# EAGLE board KramerMC_CPU_ferryTALE2020 (EAGLE 6.6.0), part 1 of 2
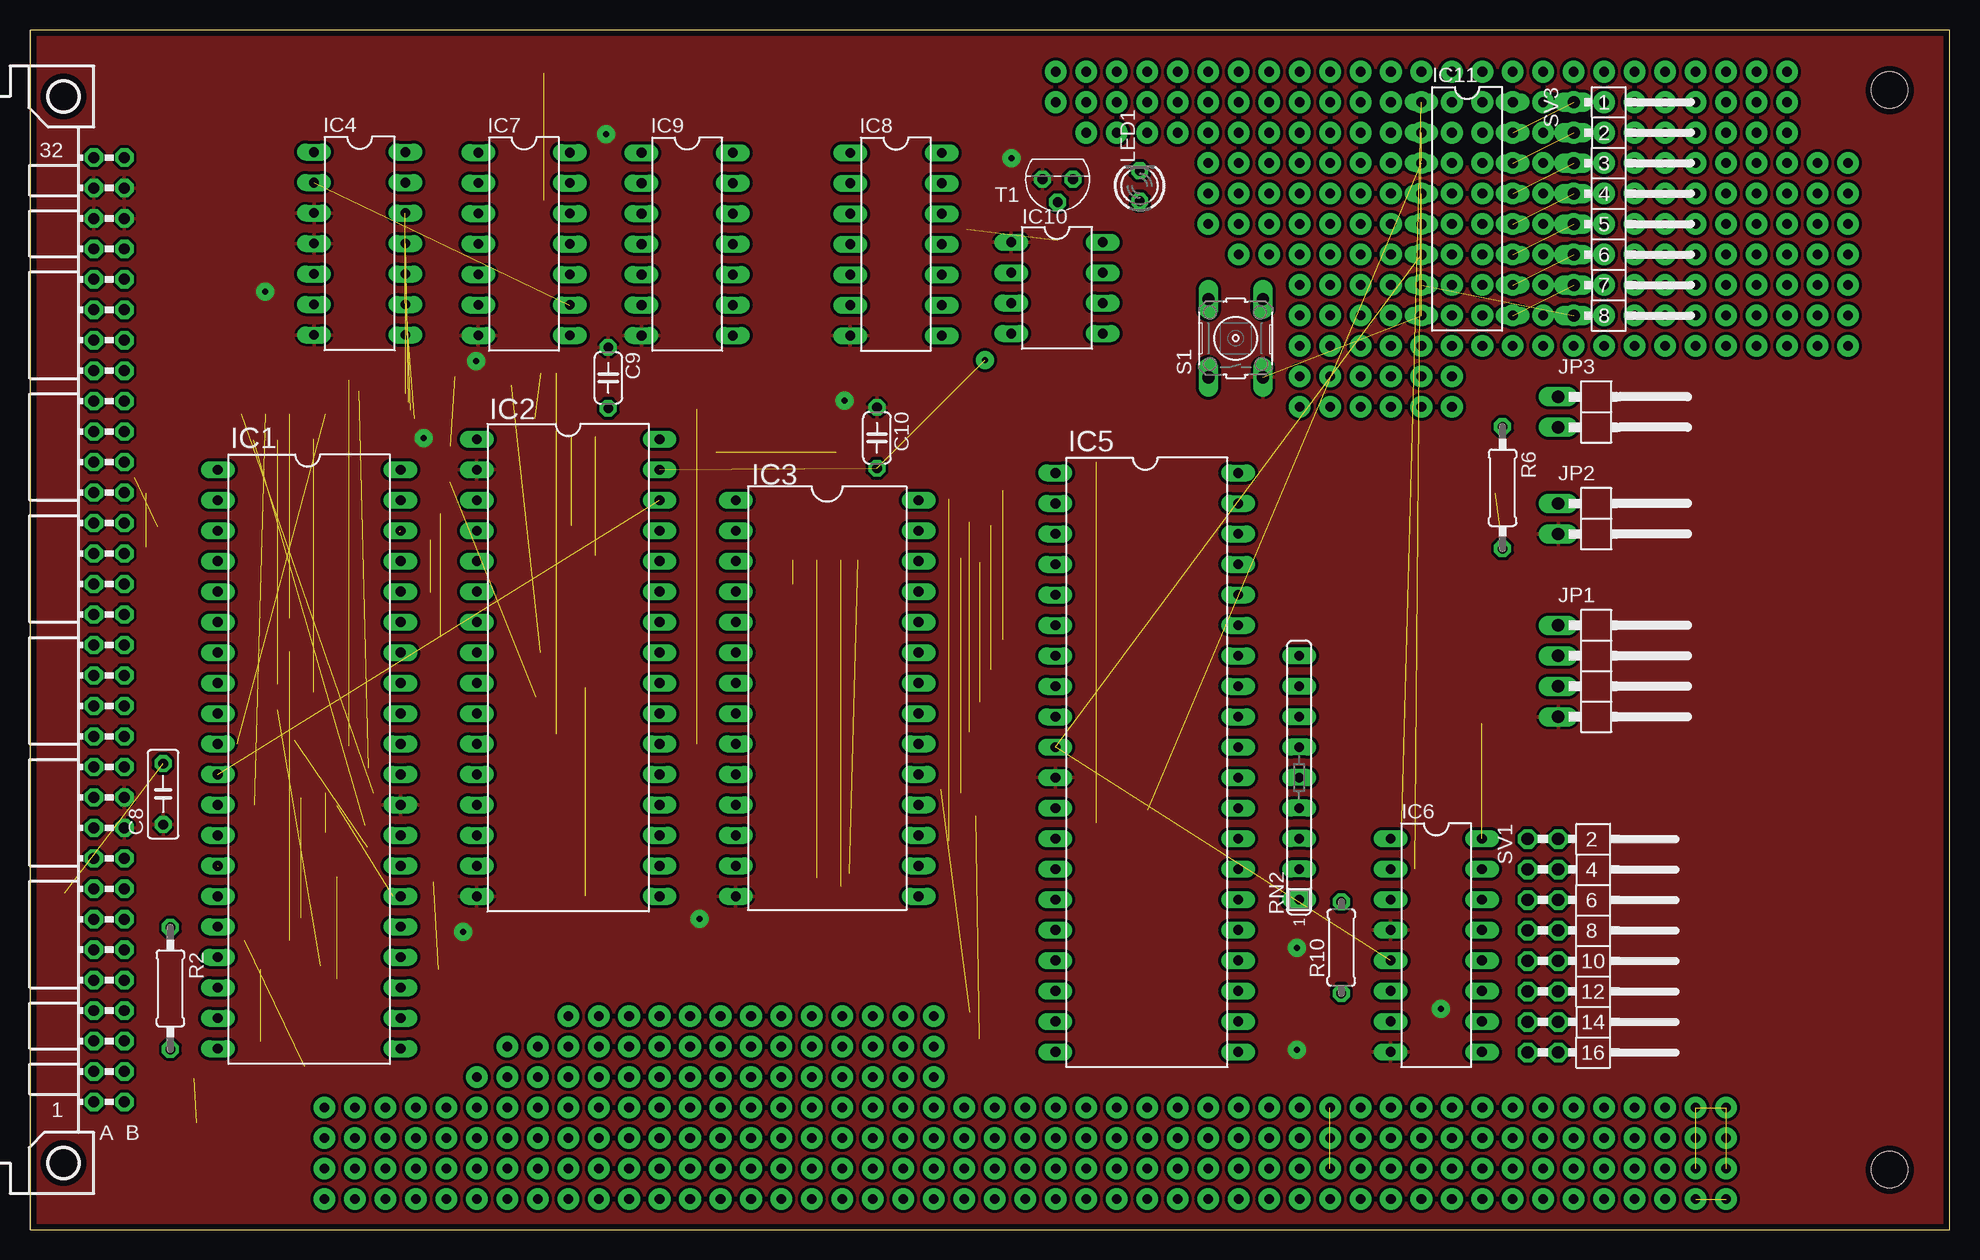
[diagram p2: board, top side]
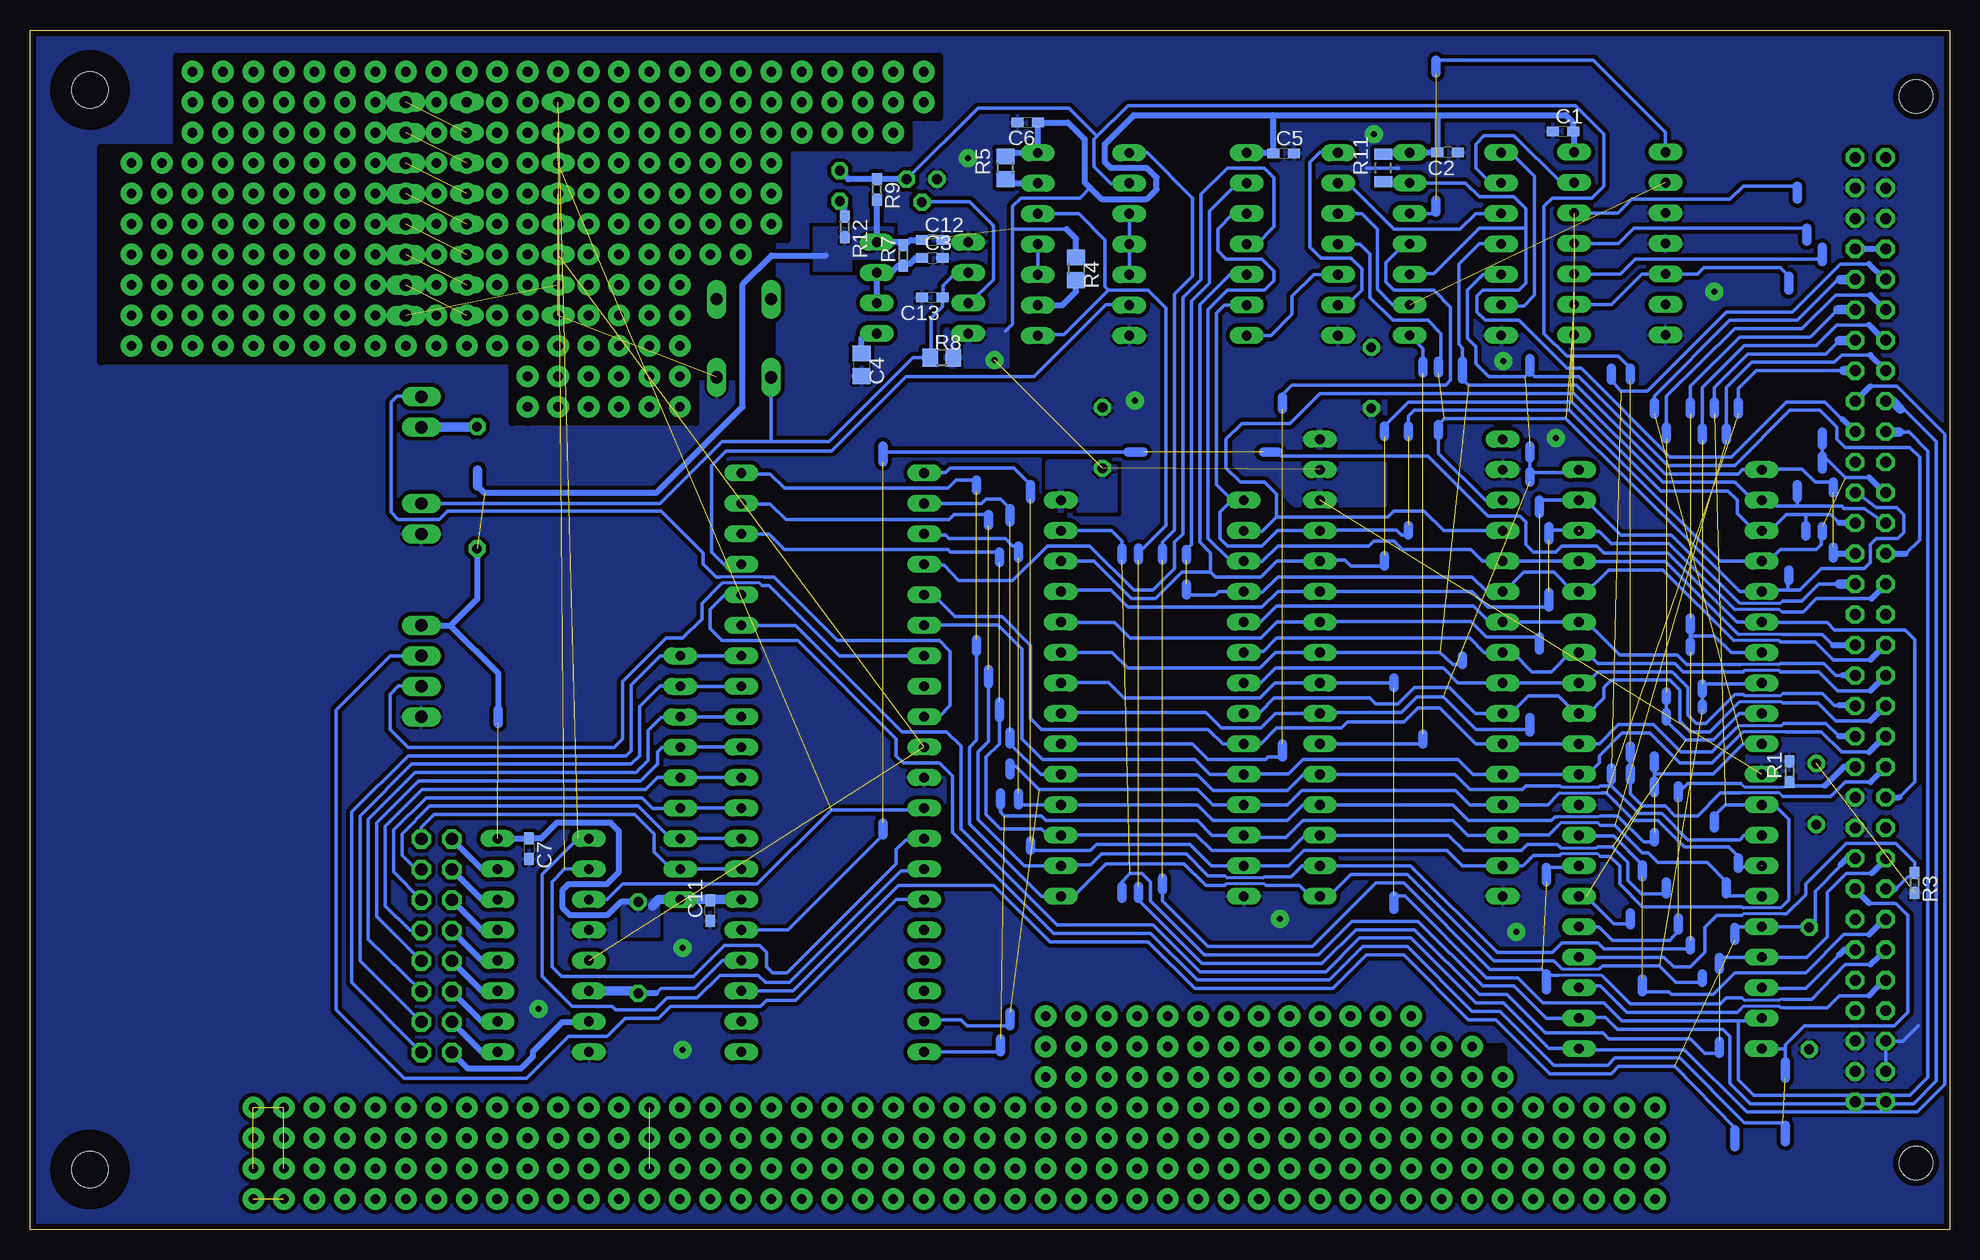
[diagram p3: board, bottom side, seen from below]

Size 160 x 100 mm. Coordinates in mm from the lower left corner, seen from the top.
Outline: 0,0 160,0 160,100 0,100 0,0
Copper layers (1*16): Top 0.035mm / dielectric 1.5mm / Bottom 0.035mm
Design rules "ferry_home *": minimum track width 0.15mm, minimum drill 0.3mm, track to track 0.25mm, track to pad 0.25mm, pad to pad 0.25mm, via to via 0.25mm, smd to smd 0.25mm, copper to edge 0.5mm, drill to drill 0.2mm, minimum pad ring 0.3mm, minimum via ring 0.3mm, stop-mask expansion 0.075mm, vias tented up to drill 0mil, thermal gap 0.2mm
Holes 3 mm at 155,95 155,5
bRestrict: area 85.5,94 to 93.1,96.5; area 88,91.4 to 93.1,94; area 105.8,68.6 to 118.5,73.7; area 98.2,71.1 to 105.8,73.7; area 24.5,2.5 to 141.4,10.2; area 44.9,10.2 to 75.3,17.8; area 37.2,10.2 to 44.9,15.2; area 98.2,73.7 to 146.5,96.5; area 146.5,73.7 to 154.1,88.9; area 152,92 to 158,98; area 152,2 to 158,8; area 93.1,91.4 to 98.2,96.5; 13 more areas

## Footprints (pad centres in the part's own frame; a part is rotated, then mirrored left to right if it is on the bottom)
C0603_NEW = smd 1 x 0.8: 1 -0.85,0; 2 0.85,0
C0805 = smd 1.3 x 1.5: 1 -0.95,0; 2 0.95,0
C050-025X075 = drill 0.813 octagon: 1 -2.54,0; 2 2.54,0
C050-024X044 = drill 0.813 octagon: 1 -2.54,0; 2 2.54,0
DIL40 = drill 0.813 long: 1 -24.13,-7.62; 2 -21.59,-7.62; 3 -19.05,-7.62; 4 -16.51,-7.62; 5 -13.97,-7.62; 6 -11.43,-7.62; 7 -8.89,-7.62; 8 -6.35,-7.62; 9 -3.81,-7.62; 10 -1.27,-7.62; 11 1.27,-7.62; 12 3.81,-7.62; 13 6.35,-7.62; 14 8.89,-7.62; 15 11.43,-7.62; 16 13.97,-7.62; 17 16.51,-7.62; 18 19.05,-7.62; 19 21.59,-7.62; 20 24.13,-7.62; 21 24.13,7.62; 22 21.59,7.62; 23 19.05,7.62; 24 16.51,7.62; 25 13.97,7.62; 26 11.43,7.62; 27 8.89,7.62; 28 6.35,7.62; 29 3.81,7.62; 30 1.27,7.62; 31 -1.27,7.62; 32 -3.81,7.62; 33 -6.35,7.62; 34 -8.89,7.62; 35 -11.43,7.62; 36 -13.97,7.62; 37 -16.51,7.62; 38 -19.05,7.62; 39 -21.59,7.62; 40 -24.13,7.62
DIL32 = drill 0.813 long: 1 -19.05,-7.62; 2 -16.51,-7.62; 3 -13.97,-7.62; 4 -11.43,-7.62; 5 -8.89,-7.62; 6 -6.35,-7.62; 7 -3.81,-7.62; 8 -1.27,-7.62; 9 1.27,-7.62; 10 3.81,-7.62; 11 6.35,-7.62; 12 8.89,-7.62; 13 11.43,-7.62; 14 13.97,-7.62; 15 16.51,-7.62; 16 19.05,-7.62; 17 19.05,7.62; 18 16.51,7.62; 19 13.97,7.62; 20 11.43,7.62; 21 8.89,7.62; 22 6.35,7.62; 23 3.81,7.62; 24 1.27,7.62; 25 -1.27,7.62; 26 -3.81,7.62; 27 -6.35,7.62; 28 -8.89,7.62; 29 -11.43,7.62; 30 -13.97,7.62; 31 -16.51,7.62; 32 -19.05,7.62
DIL28-6 = drill 0.813 long: 1 -16.51,-7.62; 2 -13.97,-7.62; 3 -11.43,-7.62; 4 -8.89,-7.62; 5 -6.35,-7.62; 6 -3.81,-7.62; 7 -1.27,-7.62; 8 1.27,-7.62; 9 3.81,-7.62; 10 6.35,-7.62; 11 8.89,-7.62; 12 11.43,-7.62; 13 13.97,-7.62; 14 16.51,-7.62; 15 16.51,7.62; 16 13.97,7.62; 17 11.43,7.62; 18 8.89,7.62; 19 6.35,7.62; 20 3.81,7.62; 21 1.27,7.62; 22 -1.27,7.62; 23 -3.81,7.62; 24 -6.35,7.62; 25 -8.89,7.62; 26 -11.43,7.62; 27 -13.97,7.62; 28 -16.51,7.62
DIL14 = drill 0.813 long: 1 -7.62,-3.81; 2 -5.08,-3.81; 3 -2.54,-3.81; 4 0,-3.81; 5 2.54,-3.81; 6 5.08,-3.81; 7 7.62,-3.81; 8 7.62,3.81; 9 5.08,3.81; 10 2.54,3.81; 11 0,3.81; 12 -2.54,3.81; 13 -5.08,3.81; 14 -7.62,3.81
DIL16 = drill 0.813 long: 1 -8.89,-3.81; 2 -6.35,-3.81; 3 -3.81,-3.81; 4 -1.27,-3.81; 5 1.27,-3.81; 6 3.81,-3.81; 7 6.35,-3.81; 8 8.89,-3.81; 9 8.89,3.81; 10 6.35,3.81; 11 3.81,3.81; 12 1.27,3.81; 13 -1.27,3.81; 14 -3.81,3.81; 15 -6.35,3.81; 16 -8.89,3.81
DIL-08 = drill 0.813 long: 1 -3.81,-3.81; 2 -1.27,-3.81; 3 1.27,-3.81; 4 3.81,-3.81; 5 3.81,3.81; 6 1.27,3.81; 7 -1.27,3.81; 8 -3.81,3.81
1X04/90 = drill 1.016 long: 1 -3.81,-3.81; 2 -1.27,-3.81; 3 1.27,-3.81; 4 3.81,-3.81
1X02/90 = drill 1.016 long: 1 -1.27,-3.81; 2 1.27,-3.81
LED3MM = drill 0.813 octagon: A -1.27,0; K 1.27,0
R0603_NEW = smd 1 x 0.8: 1 -0.85,0; 2 0.85,0
0207/10 = drill 0.813 octagon: 1 -5.08,0; 2 5.08,0
R0805 = smd 1.3 x 1.5: 1 -0.95,0; 2 0.95,0
0207/7 = drill 0.813 octagon: 1 -3.81,0; 2 3.81,0
R0805_WIDE = smd 0.9 x 1.5: 1 -1.15,0; 2 1.15,0
SIL9 = drill 0.813 long: 1 -10.16,0; 2 -7.62,0; 3 -5.08,0; 4 -2.54,0; 5 0,0; 6 2.54,0; 7 5.08,0; 8 7.62,0; 9 10.16,0
B3F-10XX = drill 1.016 long: 1 -3.251,2.261; 2 3.251,2.261; 3 -3.251,-2.261; 4 3.251,-2.261
MA08-2W = drill 1.016 octagon: 1 -8.89,-1.27; 2 -8.89,1.27; 3 -6.35,-1.27; 4 -6.35,1.27; 5 -3.81,-1.27; 6 -3.81,1.27; 7 -1.27,-1.27; 8 -1.27,1.27; 9 1.27,-1.27; 10 1.27,1.27; 11 3.81,-1.27; 12 3.81,1.27; 13 6.35,-1.27; 14 6.35,1.27; 15 8.89,-1.27; 16 8.89,1.27
MA08-1W = drill 1.016 long: 1 -8.89,0; 2 -6.35,0; 3 -3.81,0; 4 -1.27,0; 5 1.27,0; 6 3.81,0; 7 6.35,0; 8 8.89,0
TO92 = drill 0.813 octagon: 1 1.27,0; 2 0,1.905; 3 -1.27,0
MAB64 = drill 0.914 octagon: A1 39.37,-1.27; A2 36.83,-1.27; A3 34.29,-1.27; A4 31.75,-1.27; A5 29.21,-1.27; A6 26.67,-1.27; A7 24.13,-1.27; A8 21.59,-1.27; A9 19.05,-1.27; A10 16.51,-1.27; A11 13.97,-1.27; A12 11.43,-1.27; A13 8.89,-1.27; A14 6.35,-1.27; A15 3.81,-1.27; A16 1.27,-1.27; A17 -1.27,-1.27; A18 -3.81,-1.27; A19 -6.35,-1.27; A20 -8.89,-1.27; A21 -11.43,-1.27; A22 -13.97,-1.27; A23 -16.51,-1.27; A24 -19.05,-1.27; A25 -21.59,-1.27; A26 -24.13,-1.27; A27 -26.67,-1.27; A28 -29.21,-1.27; A29 -31.75,-1.27; A30 -34.29,-1.27; A31 -36.83,-1.27; A32 -39.37,-1.27; B1 39.37,1.27; B2 36.83,1.27; B3 34.29,1.27; B4 31.75,1.27; B5 29.21,1.27; B6 26.67,1.27; B7 24.13,1.27; B8 21.59,1.27; B9 19.05,1.27; B10 16.51,1.27; B11 13.97,1.27; B12 11.43,1.27; B13 8.89,1.27; B14 6.35,1.27; B15 3.81,1.27; B16 1.27,1.27; B17 -1.27,1.27; B18 -3.81,1.27; B19 -6.35,1.27; B20 -8.89,1.27; B21 -11.43,1.27; B22 -13.97,1.27; B23 -16.51,1.27; B24 -19.05,1.27; B25 -21.59,1.27; B26 -24.13,1.27; B27 -26.67,1.27; B28 -29.21,1.27; B29 -31.75,1.27; B30 -34.29,1.27; B31 -36.83,1.27; B32 -39.37,1.27 | hole 2.794: 44.45,-3.81; -44.45,-3.81

## Placement (x,y rotation side)
C1  100n  [C0603_NEW]  32.21,91.55 0 bottom
C2  100n  [C0603_NEW]  41.85,89.79 180 bottom
C3  1µ  [C0603_NEW]  84.8,81 0 bottom
C4  10n  [C0805]  90.7,72.1 270 bottom
C5  100n  [C0603_NEW]  55.51,89.72 0 bottom
C6  100n  [C0603_NEW]  76.83,92.28 180 bottom
C7  100n  [C0603_NEW]  118.41,31.75 270 bottom
C8  100n  [C050-025X075]  11.1,36.3 90 top
C9  100n  [C050-024X044]  48.2,71 270 top
C10  100n  [C050-024X044]  70.6,66 270 top
C11  100n  [C0603_NEW]  103.3,26.6 90 bottom
C12  100n  [C0603_NEW]  84.8,82.5 0 bottom
C13  1µ  [C0603_NEW]  84.8,77.7 180 bottom
IC1  Z80-CPU  [DIL40]  23.27,39.21 270 top
IC2  29F010  [DIL32]  44.86,46.83 270 top
IC3  62256  [DIL28-6]  66.45,44.29 270 top
IC4  4002N  [DIL14]  27.48,82.2 270 top
IC5  Z80-PIO  [DIL40]  93.09,38.94 270 top
IC6  74LS138N  [DIL16]  117.22,23.7 270 top
IC7  74LS00N  [DIL14]  41.18,82.16 270 top
IC8  74LS00N  [DIL14]  72.18,82.14 270 top
IC9  74LS00N  [DIL14]  54.78,82.15 270 top
IC10  NE555  [DIL-08]  85.6,78.5 270 top
IC11  74LS138N  [DIL16]  119.79,85.09 270 top
JP1  [1X04/90]  131.19,46.56 270 top
JP2  [1X02/90]  131.19,59.26 270 top
JP3  [1X02/90]  131.19,68.15 270 top
LED1  [LED3MM]  92.5,87 90 top
R1  4k7  [R0603_NEW]  13.34,38.18 90 bottom
R2  4k7  [0207/10]  11.7,20.1 270 top
R3  4k7  [R0603_NEW]  2.91,28.9 270 bottom
R4  4k7  [R0805]  72.8,80.1 270 bottom
R5  4k7  [R0805]  78.69,88.51 90 bottom
R6  1k  [0207/10]  122.74,61.84 270 top
R7  100k  [R0603_NEW]  87.2,81.2 90 bottom
R8  47k  [R0805]  84,72.7 0 bottom
R9  1k  [R0603_NEW]  89.4,86.7 270 bottom
R10  4k7  [0207/7]  109.3,23.5 90 top
R11  4k7  [R0805_WIDE]  47.2,88.5 90 bottom
R12  1k  [R0603_NEW]  92.1,83.6 270 bottom
RN2  1k  [SIL9]  105.79,37.67 90 top
S1  [B3F-10XX]  100.5,74.3 90 top
SV1  [MA08-2W]  126.11,23.66 270 top
SV3  [MA08-1W]  128.68,85.09 270 top
T1  BC237  [TO92]  85.66,87.56 180 top
X1  KRAMER_SYSBUS_VG64B_MA  [MAB64]  6.6,50 270 top

## Tracks (layer width: path | path; a pad name or v marks a point on that pad's centre or on a via)
+5V  (via drill 0.5 pad 1.5)  (7 unrouted)
  Bottom 0.3: 2.6,17 3.9,15.7 X1.A3 X1.A2 | 71.65,86.85 72.5,86 77.4,86 78.1,85.3 78.1,83.4 | 78.1,83.4 78.1,75.5 78.7,74.9 | IC7.14 46.77,89.78 R11.2 | 73.6,83.4 78.1,83.4
  Bottom 0.5: 42.7,92.9 32,92.9 31.4,92.3 31.4,91.59 C1.2 31.29,91.48 IC4.14 | IC6.16 C7.1 117.4,32.6 116.1,33.9 111.6,33.9 110.9,33.2 110.9,29.8 111.9,28.8 115.1,28.8 115.6,28.3 115.6,26.8 115,26.2 111.9,26.2 110.79,27.31 R10.2 | C11.2 103.34,27.45 103.4,27.51 | JP1.1 124.93,50.37 | 124.93,50.37 122.7,52.6 122.7,56.72 R6.2 | R9.2 89.41,84.54 IC10.8 87.6,82.3 87.35,82.05 R7.2 87.05,82.05 86.6,82.5 C12.1 | 42.7,92.9 C2.2 IC7.14 | 56.4,92.9 68,92.9 70.4,90.5 70.4,89 69.9,88.5 66.9,88.5 66.1,87.7 66.1,86.7 66.9,85.9 70.7,85.9 71.65,86.85 72.1,87.3 72.1,90.9 73.48,92.28 C6.1 IC8.14 78.39,89.76 R5.2 | 56.4,92.9 42.7,92.9 | 56.4,92.9 56.36,92.86 C5.1 58.54,89.72 IC9.14 | 124.93,50.37 124.93,50.33 121,46.4 121,43.3 | 122.7,62 122.1,61.4 107.8,61.4 100.6,68.6 100.6,78.8 98.2,81.2 93.65,81.2 | R4.1 72.8,82.6 73.6,83.4
  Bottom 0.8: IC5.26 103.4,27.51 RN2.1 107.59,27.51 108.1,27 | 109.1,27.51 R10.2 | 121,43.3 121,42.2 | 122.7,62 122.7,63.3
  other vias: 79.6,72.5
  pour Bottom (isolate 0.35, rank 5): 2.2,11.2 2.2,28.9 4.3,28.9 4.3,16.8 13.2,16.8 13.2,11.2
  pour Bottom (isolate 0.3, rank 5): 16.9,41.3 9.1,41.3 9.1,36.9 16.9,36.9
  pour Bottom (isolate 0.35, rank 5): 47.1,69 52.6,69 54.6,67 59.1,67 60.1,66 60.1,63.5 59.1,62.5 56.6,62.5 54.6,60.5 47.1,60.5
  pour Bottom (isolate 0.35, rank 5): 75.1,64 69.6,64 69.6,60 75.1,60
  pour Bottom (isolate 0.35, rank 5): 83.6,75 78.6,75 78.6,72 83.6,72
  pour Bottom (isolate 0.35, rank 5): 88.1,83.5 94.6,83.5 94.6,80 91.6,80 91.6,81 88.1,81
  pour Bottom (isolate 0.3, rank 5): 107.6,27.5 107.6,24.5 110.6,24.5 110.6,27.5
+5VG
  Bottom 0.5: X1.A29 X1.B29
/BAO
  Bottom 0.23: 13.8,18.5 14.1,18.5 14.2,18.6 17.2,18.6 17.4,18.4
  Bottom 0.3: X1.A5 5.49,20.79 | 6.7,19.5 9.2,19.5 10.2,18.5 13.8,18.5 | IC1.23 30.75,20.3 29.1,20.3 26.9,18.1 17.7,18.1 17.4,18.4
  Bottom 0.5: 5.49,20.79 6.7,19.5
/BUSRQ  (1 unrouted)
  Bottom 0.23: 17.4,37.2 17.1,36.9 13.77,36.9 R1.1
  Bottom 0.3: 22.6,36.4 21.8,37.2 17.4,37.2 | IC1.25 29.24,25.24 28.1,24.1 23.3,24.1 22.6,24.9 22.6,25 | 10.4,37 13.01,37 R1.1
  Bottom 0.5: X1.B12 8.83,38.57 10.4,37
  Bottom 0.8: 22.6,36 22.6,36.4 22.6,37 | 22.6,25 22.6,26
/HALT
  Bottom 0.3: IC1.18 15.59,20.1 12,20.1 9.2,22.9
  Bottom 0.5: X1.B6 8.77,23.33 9.2,22.9
/INT  (1 unrouted)
  Bottom 0: 17.9,8.5 17.9,8.3
  Bottom 0.3: IC5.23 96.41,19.89 87.6,28.7 79.7,28.7 75,24 66.8,24 62.9,20.1 51.4,20.1 48.6,22.9 45.5,22.9 40.1,17.5 37.8,17.5 33.3,13 28.2,13 27.6,13.6 22.9,13.6 17.9,8.5 | 17.9,25.2 17.76,25.24 IC1.16 11.76,25.24 R2.1 11.2,25.68 11.2,28.2 9.1,30.3 9.1,30.4
  Bottom 0.5: X1.B9 8.55,30.95 9.1,30.4
  Bottom 0.8: 17.9,25.2 17.9,24.1 | 17.9,8.3 17.9,6.9
/IORQ  (1 unrouted)
  Bottom 0.3: IC5.36 102.09,52.91 103.3,51.7 103.3,50.1 102.3,49.1 96,49.1 87.8,40.9 87.8,39.5 87.2,38.9 84.2,38.9 83.1,37.8 83.1,33.1 74.7,24.7 66.6,24.7 62.7,20.8 51.7,20.8 48.9,23.6 45.2,23.6 39.8,18.2 37.5,18.2 33,13.7 28.5,13.7 27.9,14.3 22.5,14.3 17.1,8.9 13.9,8.9 13.7,8.7 | 13.7,15 13.7,15.4 12.1,17 4.6,17 3.5,18.1 3.5,26.2 4.5,27.2 6.7,27.2 | 13.7,15 13.7,14 | IC1.20 13.78,15.08 13.7,15
  Bottom 0.5: X1.B8 7.87,28.37 6.7,27.2
  Bottom 0.8: 13.7,7.3 13.7,8.7 | 13.7,12.6 13.7,14
/M1  (2 unrouted)
  Bottom 0.23: 13.8,19.2 14.1,19.2 14.2,19.1 17.1,19.1 17.3,19.3 | 28.9,21.1 29,21.2 32.6,21.2
  Bottom 0.3: 6.6,22.1 8.7,22.1 11.5,19.2 13.8,19.2 | 33.6,30.2 31.01,30.2 IC1.27 | IC8.1 66.86,89.76 63.1,86 63.1,79.5 64.6,78 64.6,58.3 65.6,57.3 65.6,56.8 | 17.3,19.3 18.6,19.3 19.1,18.8 26.6,18.8 28.9,21.1 | 32.6,21.2 33.1,21.2 33.6,21.3 34,21.7 38.3,21.7 45.5,28.9 47.8,28.9 53.1,23.6 61.8,23.6 65.6,27.4 65.6,28.3
  Bottom 0.5: X1.A6 6.6,22.1
  Bottom 0.8: 33.6,30.2 33.6,29 | 33.6,21.3 33.6,20 | 65.6,56.8 65.6,55.8 | 65.6,28.3 65.6,29.3
/MEMDI
  Bottom 0.3: 35.3,83.5 35.3,85.1 36.3,86.1 39.2,86.1 40.34,87.24 IC7.13 46.79,87.24 R11.1 | 35.3,83.5 39.2,83.5 43,79.7 44.91,79.7 IC7.10 | 35.3,83.5 35.3,78.9 35.9,78.3 38.9,78.3 39.4,77.8 39.4,76.5 38.7,75.8 35.9,75.8 31.9,71.8 30.7,71.8 23.3,64.4 18.2,64.4 13.6,69 10.4,69 9.1,67.7 8.9,67.54
  Bottom 0.5: 8.9,67.54 X1.B23
/MREQ  (1 unrouted)
  Bottom 0.3: IC3.22 74.03,45.6 70.1,45.6 68.8,44.3 57.5,44.3 56.24,45.56 IC2.24 46.74,45.56 46.3,46 | 17.6,17.4 17.6,12.5 16.3,11.2 3.3,11.2 1.8,12.7 1.8,64.9 3.41,66.51 3.42,66.5 4.2,66.5 | 17.6,17.4 16.6,17.4 16.4,17.6 15.67,17.6 IC1.19 | 17.6,17.4 27.3,17.4 28.8,18.9 33.9,18.9 36,21 38.6,21 45.4,27.8 46.3,27.8
  Bottom 0.8: 46.3,27.8 46.3,26.7 | 46.3,46 46.3,45.2 | X1.A23 5.21,66.51 5.2,66.5 4.2,66.5
/NMI  (2 unrouted)
  Bottom 0.3: X1.A9 5.33,30.87 | 6.5,29.7 8.6,29.7 10.2,28.1 10.2,24.4 11.9,22.7 IC1.17 19.2,22.7 | IC8.8 75.91,74.6 73.8,74.6 70.1,78.3 | 19.2,14.7 20.4,14.7 21.6,15.9 28.4,15.9 28.9,16.4 33.7,16.4 36.9,19.6 39.2,19.6 44.6,25 49.5,25 52.3,22.2 62.3,22.2 67.6,27.5 67.6,27.6 | 67.6,56.8 67.2,56.8 65.3,58.7 65.3,76.8 66.8,78.3 70.1,78.3 | IC8.12 72.58,84.68 70.4,82.5 70.4,78.6 70.1,78.3
  Bottom 0.5: 5.33,30.87 6.5,29.7
  Bottom 0.8: 19.2,22.7 19.2,21.7 | 19.2,15.7 19.2,14.7 | 67.6,27.6 67.6,28.6 | 67.6,55.8 67.6,56.8
/RD
  Bottom 0.3: X1.B24 7.85,69.05 | 6.6,70.3 4.4,70.3 0.4,66.3 0.4,12.1 2.7,9.8 16.9,9.8 22.1,15 30.81,15 IC1.21 30.91,15.1 33.4,15.1 37.2,18.9 39.5,18.9 44.9,24.3 49.2,24.3 52,21.5 62.5,21.5 66.4,25.4 74.4,25.4 82.4,33.4 82.4,40.3 83.6,41.5 87.3,41.5 96.17,50.37 IC5.35
  Bottom 0.5: 7.85,69.05 6.6,70.3
/RESET  (2 unrouted)
  Bottom 0.23: 13.9,36.1 14.2,36.4 17.4,36.4
  Bottom 0.3: 6.6,37.3 8.7,37.3 9.9,36.1 13.9,36.1 | IC1.26 30.28,27.78 28,25.5 26.7,25.5 26.6,25.4 | 26.6,37.5 26.6,36.3 25.6,35.3 23.7,35.3 22.9,34.5 21,34.5 19.1,36.4 17.4,36.4 | IC8.2 68.39,87.2 69.9,87.2 71.3,88.6 71.3,90.9 71.05,91.15 | 71.05,91.15 68.5,93.7 31.2,93.7 28.8,91.3 28.8,87 29.8,86 33.1,86 33.8,85.3 33.8,74.7 31.9,72.8 27.6,72.8 26.6,71.8 | 26.6,38.5 26.6,39.3 | 71.05,91.15 73.4,93.5 80.99,93.5 T1.3
  Bottom 0.5: X1.A12 6.6,37.3 | T1.3 R9.1 91.78,87.55 LED1.K
  Bottom 0.8: 26.6,37.5 26.6,38.5 | 26.6,25.4 26.6,26.4 | 26.6,70.8 26.6,71.8 | 26.6,39.3 26.6,40.3
/RFSH  (1 unrouted)
  Bottom 0.3: X1.A7 5.43,25.87 | 6.7,24.6 8.8,24.6 12,21.4 17.9,21.4 19.7,19.6 23.2,19.6 23.4,19.8 25.6,19.8 | IC1.28 30.76,32.86 30.7,32.8 28,32.8 25.6,30.4
  Bottom 0.5: 5.43,25.87 6.7,24.6
  Bottom 0.8: 25.6,19.8 25.6,20.9 | 25.6,29.4 25.6,30.4
/WAIT
  Bottom 0.23: 13.8,26.3 17.2,26.3 17.3,26.2
  Bottom 0.3: IC1.24 23.8,22.7 23,21.9 21.6,21.9 20.4,23.1 20.4,25.2 19.4,26.2 17.3,26.2 | 13.8,26.3 13.6,26.3 12,27.9 12,28.8 8.6,32.2 4.5,32.2 2.9,30.6 R3.1 3.26,29.4 3.5,29.4 4.49,28.41
  Bottom 0.5: X1.A8 4.49,28.41
/WR  (1 unrouted)
  Bottom 0.3: 4.1,68.4 3.8,68.4 1.1,65.7 1.1,12.4 3,10.5 16.6,10.5 18.3,12.2 18.3,16.1 18.9,16.7 27.7,16.7 28.7,17.7 30.1,17.7 30.2,17.6 30.87,17.6 IC1.22 33.62,17.62 36.3,20.3 38.9,20.3 44.3,25.7 49.8,25.7 52.6,22.9 62.1,22.9 66.6,27.4 66.6,29 67.3,29.7 68.3,29.7 69,29 69,28.6 | IC3.27 69.86,58.26 69,57.4 69,56.8
  Bottom 0.8: X1.A24 4.75,69.05 4.1,68.4 | 69,56.8 69,55.8 | 69,28.6 69,27.6
AB0
  Bottom 0.23: 13.6,41.5 17.2,41.5 17.3,41.4
  Bottom 0.3: IC1.30 IC2.12 39.74,37.94 41,39.2 53.9,39.2 55.1,38 58.77,38 IC3.10 61.64,37.94 62.9,39.2 75.6,39.2 77.3,40.9 77.3,48.4 79.3,50.4 85.44,50.4 IC5.6 | X1.A13 5.39,41.11 | 6.7,39.8 9,39.8 10.7,41.5 13.6,41.5 | 30.83,38 IC1.30 | 17.3,41.4 19.8,38.9 22.5,38.9 25,41.4 27.3,41.4 29.2,39.5 29.2,38.9 30.2,37.9 30.85,37.9 IC1.30
  Bottom 0.5: 5.39,41.11 6.7,39.8
AB1
  Bottom 0.23: 13.8,42.2 14,42 17.6,42
  Bottom 0.3: 9.19,41.11 10.3,42.2 13.8,42.2 | 17.6,42 19.8,39.8 22.4,39.8 24.7,42.1 27.6,42.1 29.2,40.5 30.87,40.5 IC1.31 IC2.11 39.48,40.48 42.5,43.5 44.3,43.5 45.5,42.3 50.2,42.3 50.7,41.8 56.1,41.8 57.4,40.5 58.81,40.5 IC3.9 60.58,40.48 61.8,41.7 75.7,41.7 76.6,42.6 76.6,48.7 79,51.1 82.9,51.1 84.7,52.9 IC5.5
  Bottom 0.5: X1.B13 9.19,41.11
AB2
  Bottom 0.23: 13.9,43.9 14,44 17.5,44 17.6,43.9
  Bottom 0.3: X1.A14 5.35,43.65 | 6.6,42.4 9.5,42.4 11,43.9 13.9,43.9 | 17.6,43.9 20,41.5 21.6,41.5 22.5,42.4 22.5,45 23.3,45.8 28.2,45.8 28.8,45.2 28.8,44.3 30.1,43 30.87,43 IC1.32 31.12,43.02 32.6,44.5 35.1,44.5 36.5,43.1 37.1,43.1 37.2,43 IC2.10 39.52,43.02 41.7,45.2 44.6,45.2 46,43.8 47.8,43.8 48.3,44.3 56.3,44.3 57.5,43.1 58.75,43.1 IC3.8
  Bottom 0.5: 5.35,43.65 6.6,42.4
AB3
  Bottom 0.23: 13.9,44.7 14.1,44.5 17.1,44.5 17.2,44.6
  Bottom 0.3: 17.2,44.6 17.9,44.6 20.3,42.2 21.1,42.2 21.8,42.9 21.8,45.2 23.1,46.5 29.3,46.5 30.2,45.6 30.85,45.6 IC1.33 IC2.9 40.96,45.56 42.2,46.8 56.2,46.8 57.4,45.6 58.79,45.6 IC3.7 | 13.9,44.7 10.6,44.7 9.6,43.7 9.2,43.7
  Bottom 0.5: X1.B14 7.95,43.65 8,43.7 9.2,43.7
AB4
  Bottom 0.23: 14.1,46.5 14.2,46.6 17.1,46.6 17.2,46.5
  Bottom 0.3: X1.A15 5.33,46.17 | 6.6,44.9 9.3,44.9 10.9,46.5 14.1,46.5 | IC3.6 58.73,48.2 57.2,48.2 56.1,49.3 40,49.3 38.8,48.1 IC2.8 36.4,48.1 34.8,46.5 33.2,46.5 31.6,48.1 IC1.34 30.2,48.1 29.3,47.2 22.9,47.2 22.2,46.5 17.2,46.5
  Bottom 0.5: 5.33,46.17 6.6,44.9
AB5
  Bottom 0.23: 14.1,47.2 14.2,47.1 17.4,47.1
  Bottom 0.3: 8.91,46.19 9.5,46.2 10.5,47.2 14.1,47.2 | 17.4,47.1 21.9,47.1 22.7,47.9 27.5,47.9 30.2,50.6 30.85,50.6 IC1.35 IC2.7 38.34,50.64 39.7,52 56.1,52 57.5,50.6 58.79,50.6 IC3.5
  Bottom 0.5: X1.B15 8.91,46.19
AB6  (1 unrouted)
  Bottom 0.23: 14.2,49.1 18,49.1
  Bottom 0.25: 14.1,49 14.2,49.1
  Bottom 0.3: X1.A16 5.37,48.73 | 6.6,47.5 9.7,47.5 11.2,49 14.1,49 | 18,49.1 23.9,55 28.4,55 30.3,53.1 30.81,53.1 IC1.36 31.38,53.18 33,54.8 35.5,54.8 37.1,53.2 IC2.6 38.58,53.18 39.8,54.4 56,54.4 57.3,53.1 58.75,53.1 IC3.4 58.85,53.2 60.9,53.2 61.2,52.9 63.6,52.9 | 63.6,56.7 63.2,57.1 63.2,77.4 61.7,78.9 61.7,84.9 59.4,87.2 58.62,87.2 IC9.13
  Bottom 0.5: 5.37,48.73 6.6,47.5
  Bottom 0.8: 63.6,56.7 63.6,55.8 | 63.6,53.8 63.6,52.9
AB7
  Bottom 0.23: 13.9,49.6 17.6,49.6
  Bottom 0.25: 17.6,49.6 17.7,49.7
  Bottom 0.3: X1.B16 7.93,48.73 7.96,48.7 | 9.7,48.7 10.6,49.6 13.9,49.6 | 17.7,49.7 23.7,55.7 30.87,55.7 IC1.37 IC2.5 38.92,55.72 39.9,56.7 45.6,56.7 46.3,57.4 48,57.4 48.4,57 56,57 57.3,55.7 58.81,55.7 IC3.3 58.91,55.8 60,55.8 61.8,57.6 61.8,76.7 60.2,78.3 57.1,78.3 56.3,79.1 56.3,79.9 57.3,80.9 60.3,80.9 61,81.6 61,83.4 59.71,84.69 IC9.12
  Bottom 0.5: 7.96,48.7 9.7,48.7
AB8  (2 unrouted)
  Bottom 0.23: 13.9,51.5 14,51.5 14.2,51.7 17.9,51.7
  Bottom 0.3: X1.A18 5.33,53.77 | 6.5,52.6 11.1,52.6 12.2,51.5 13.9,51.5 | IC3.25 73.95,53.3 69.9,53.3 68.5,51.9 57.3,51.9 56,53.2 53.5,53.2 53.48,53.18 IC2.27 52.46,53.2 39.8,53.2 38.5,51.9 33.4,51.9 | IC1.38 31.36,58.26 31.4,58.3 33.4,58.3 | 30.83,58.2 29.2,58.2 28.2,57.2 23.4,57.2 17.9,51.7
  Bottom 0.5: 5.33,53.77 6.5,52.6
  Bottom 0.8: 33.4,57.5 33.4,58.3 33.4,58.6 | 33.4,51.9 33.4,53.1
AB9  (1 unrouted)
  Bottom 0.23: 17.6,52.3 17.5,52.2 14.1,52.2 13.9,52.4
  Bottom 0.3: IC3.24 74.03,50.6 69.6,50.6 68.3,49.3 57.4,49.3 56.06,50.64 IC2.26 52.42,50.7 39.9,50.7 38.6,49.4 34.2,49.4 | 34.2,60.8 IC1.39 30.79,60.7 30.2,60.7 27.4,57.9 23.2,57.9 17.6,52.3 | 13.9,52.4 12.3,52.4 10.89,53.81 10.88,53.8 9.2,53.8
  Bottom 0.8: 34.2,49.4 34.2,48.3 | 34.2,60.8 34.2,59.7 | X1.B18 9.19,53.81 9.2,53.8
AB10  (2 unrouted)
  Bottom 0.3: X1.A19 5.35,56.35 | IC3.21 73.99,43.1 62,43.1 60.7,41.8 57.4,41.8 56.18,43.02 IC2.23 52.3,43.2 52.2,43.1 45.7,43.1 44.4,44.4 42.2,44.4 39.5,41.7 35.3,41.7 35,41.5 | 3.65,56.35 2.5,57.5 2.5,64.4 3.3,65.2 8.7,65.2 9.4,65.9 9.4,66.9 10.8,68.3 13.3,68.3 17.9,63.7 23.5,63.7 30.9,71.1 34.6,71.1 35,71.5 35.4,71.1 38.4,71.1 39.5,72.2 39.5,73.6 40.2,74.3 40.2,78.3 38.88,79.62 IC7.5 | IC1.40 31.36,63.34 31.6,63.1 34.7,63.1 35,63.2 35,64.3
  Bottom 0.5: X1.A19 3.65,56.35
  Bottom 0.8: 35,71.5 35,72.6 | 35,64.3 35,65.3 | 35,41.5 35,42.7 | 35,63.2 35,62.3
AB11  (2 unrouted)
  Bottom 0.3: IC3.23 69.8,48.1 68.5,46.8 57.5,46.8 56.2,48.1 IC2.25 42.5,48.1 41.4,47.1 40.6,47.1 | X1.B19 8.25,56.35 | 9.4,56.3 9.7,56 | 40.6,70.9 40.1,70.4 31.1,70.4 23.7,63 17.6,63 17.26,63.34 IC1.1 15.59,63.4 12.3,63.4 11.2,62.3 9.7,62.3 | IC7.4 37.41,82.2 39.2,82.2 40.9,80.5 40.9,73.8 40.6,73.5 40.6,72.4
  Bottom 0.5: 8.25,56.35 8.4,56.3 9.4,56.3
  Bottom 0.8: 9.7,56.9 9.7,56 | 9.7,62.3 9.7,61.4 | 40.6,70.9 40.6,72.4 | 40.6,47.1 40.6,47.8
AB12  (1 unrouted)
  Bottom 0.3: IC2.4 42.16,58.26 43.8,59.9 46.3,59.9 46.8,59.4 56.1,59.4 | X1.A20 5.39,58.89 7.1,60.1 8.8,60.1 9,60.3 12.7,60.3 | 12.7,60.3 14.4,60.3 14.9,60.8 IC1.2 16.4,60.8 17.9,62.3 23.9,62.3 31.3,69.7 52.5,69.7 55,67.2 59,67.2 60.3,65.9 60.3,63.5 59.1,62.3 57.1,62.3 56.1,61.3 56.1,59.4 | 56.1,59.4 57.3,58.2 58.77,58.2 IC3.2 | IC4.12 27.66,84.74 26.5,85.9 18.3,85.9 17.2,87 12.7,87 | 12.7,61 12.7,60.3
  Bottom 0.8: 12.7,87 12.7,85.9 | 12.7,62.1 12.7,61
AB13  (2 unrouted)
  Bottom 0: 12,59.6 12,58.7
  Bottom 0.3: X1.B20 7.9,58.9 | 9.2,58.9 9.9,59.6 12,59.6 | 12,59.6 13.6,59.6 14.9,58.3 15.61,58.3 IC1.3 16.2,58.2 17.7,59.7 17.7,60.8 18.46,61.56 24.06,61.56 31.5,69 45.1,69 47.1,67 | 47.1,55.3 49.9,55.3 50.4,55.8 52.4,55.8 IC2.28 56.08,55.72 57.4,54.4 61.2,54.4 61.6,54.8 | IC9.10 59.99,79.61 62.5,77.1 62.5,57.3 61.6,56.4 61.6,54.8 | IC4.11 27.6,82.2 26.3,83.5 12,83.5 11.9,82.4 | 12,57.8 12,59.6 | IC3.26 71.32,55.72 68.2,52.6 66.2,52.6 64,54.8 61.6,54.8
  Bottom 0.5: 7.9,58.9 9.2,58.9
  Bottom 0.8: 47.1,67 47.1,66.1 | 47.1,56.2 47.1,55.3 | 11.9,82.4 11.9,83.5 | 12,58.7 12,57.8
AB14  (3 unrouted)
  Bottom 0.3: X1.A21 5.43,61.43 | 6.7,62.7 8.7,62.7 10.6,64.6 | 10.6,64.6 10.6,64.5 | 45.1,67 45.1,67.8 44.6,68.3 31.7,68.3 19.12,55.72 IC1.4 15.08,55.72 14.1,56.7 11.1,56.7 10.7,57.1 10.7,57.7 10.6,57.8 | 45.1,57.9 45.7,57.9 46.1,58.3 52.4,58.3 52.44,58.26 IC2.29 56.04,58.26 57.3,57 60.2,57 60.8,57.6 60.8,59.8 59.8,60.8 | IC9.9 60.43,77.07 61.1,76.4 61.1,62.1 59.8,60.8 | IC4.10 27.44,79.66 26.2,80.9 10.8,80.9 10.6,80.7 | 10.6,64.6 10.6,65.4 | 59.8,60.8 58.8,60.83 | 58.8,60.83 IC3.1 | 58.8,60.83 59.77,60.83 59.8,60.8
  Bottom 0.5: 5.43,61.43 6.7,62.7
  Bottom 0.8: 10.6,57.8 10.6,58.6 | 10.6,64.5 10.6,63.4 | 45.1,67 45.1,66.1 | 45.1,58.7 45.1,57.9 | 10.6,80.7 10.6,81.9 | 10.6,65.4 10.6,66.5
AB15  (2 unrouted)
  Bottom 0.3: X1.B21 7.73,61.43 6.1,60.2 4.4,60.2 3.8,59.6 3.8,58.1 4.3,57.6 6.1,57.6 6.6,57.1 6.6,55.6 7.1,55.1 10.7,55.1 12.5,53.3 13.5,53.3 | 13.5,53.3 14.2,53.3 15.5,53.23 15.6,53.23 IC1.5 17.48,53.18 21.2,56.9 32,67.6 42.1,67.6 42.6,67.1 | IC9.4 49.15,82.15 48.3,81.3 48.3,77.7 46.4,75.8 43.5,75.8 42.4,74.7 42.4,72.7 42.6,72.4 | IC4.9 28.18,77.12 25.64,79.66 IC4.5 21.04,79.66 20.5,80.2 14.1,80.2 13.4,79.5 13.4,78.6 | 13.5,53.3 13.5,54 13.4,54.1 | IC2.3 38.7,60.8 42.6,64.7 42.6,66.2
  Bottom 0.8: 42.6,72.4 42.6,71.4 | 42.6,67.1 42.6,66.2 | 13.4,79.5 13.4,78.3 | 13.4,54.1 13.4,55
CLK  (2 unrouted)
  Bottom 0.3: 4.17,36.03 2.9,37.3 2.9,49.2 3.7,50 9.6,50 10.2,50.6 15.61,50.6 IC1.6 17.74,50.64 23.5,56.4 28.8,56.4 29.4,57 32.3,57 32.8,56.5 34.7,56.5 35.3,57.1 35.3,59 35.8,59.5 38.5,59.5 43.5,64.5 55.7,64.5 56,64.8 | IC5.25 96.83,24.97 88.9,32.9 | 88.9,64.8 68.5,64.8
  Bottom 0.5: X1.A11 4.17,36.03
  Bottom 0.8: 88.9,32.9 88.9,33.9 | 88.9,64 88.9,64.8 88.9,65.3 | 68.5,64.8 67.2,64.8 | 57.2,64.8 56,64.8
DB0  (3 unrouted)
  Bottom 0.23: 32.6,36.3 32.5,36.4 29,36.4
  Bottom 0.3: 15.67,30.3 16.9,30.3 17.6,30.1 | 17.6,31 17.6,31.1 18.4,31.9 22.1,31.9 24.3,34.1 26.3,34.1 28.6,36.4 29,36.4 | 17.6,69 17.6,70.1 16.1,71.6 8.8,71.6 | 78.3,37.8 78.3,37.9 | 78.3,17 81.9,17 82.4,17.5 85.32,17.5 IC5.19 | 78.3,38.6 77.8,38.6 75.9,36.7 62.7,36.7 61.4,35.4 IC3.11 55.2,35.4 54,36.6 41.2,36.6 40,35.4 IC2.13 33.5,35.4 32.6,36.3
  Bottom 0.8: 17.6,30.1 17.6,31 | 17.6,69 17.6,68 | 78.3,38.9 78.3,38.6 78.3,37.9 | 78.3,18.1 78.3,17 | X1.B25 8.79,71.59 8.8,71.6
DB1  (2 unrouted)
  Bottom 0.23: 29.1,33.7 29.3,33.9 32.4,33.9 32.6,33.7
  Bottom 0.3: IC1.15 15.67,27.8 18.4,27.8 18.6,28 | X1.A25 5.33,71.63 | 18.6,29 20.2,30.6 24.3,30.6 25.1,31.4 25.6,31.4 27.9,33.7 29.1,33.7 | 18.6,66.8 18.6,70.2 16.5,72.3 9.6,72.3 9,72.9 6.6,72.9 | 79.1,35.4 79.1,34.8 78.8,34.5 75.7,34.5 75.3,34.1 62.7,34.1 61.46,32.86 IC3.12 58.67,32.7 55.3,32.7 53.9,34.1 41.4,34.1 40.16,32.86 IC2.14 37.16,32.86 37.12,32.9 33.4,32.9 32.6,33.7 | 79.1,14.8 IC5.20
  Bottom 0.5: 5.33,71.63 6.6,72.9
  Bottom 0.8: 18.6,66.8 18.6,65.8 | 18.6,29 18.6,28 | 79.1,35.4 79.1,36.4 | 79.1,15.9 79.1,14.8
DB2  (2 unrouted)
  Bottom 0.23: 13.9,27 14.1,26.8 17.2,26.8 17.3,26.9 | 29.1,31.1 29.3,31.3 32.4,31.3 32.5,31.2
  Bottom 0.3: 19.6,69 19.6,70.2 16.8,73 10.3,73 9.2,74.1 | 19.6,34.5 18.7,35.4 IC1.12 14.6,35.4 13.4,34.2 13.4,27.5 13.9,27 | 76.6,31.6 71.6,31.6 71.1,32.1 63.3,32.1 61.52,30.32 IC3.13 58.81,30.3 55.1,30.3 53.8,31.6 41.9,31.6 40.62,30.32 IC2.15 35.58,30.32 34.7,31.2 32.5,31.2 | 76.6,62.1 78,63.5 83.3,63.5 83.7,63.1 85.44,63.1 IC5.1 | 17.3,26.9 25.6,26.9 27.5,28.8 27.5,30.3 28.3,31.1 29.1,31.1
  Bottom 0.8: 19.6,69 19.6,68 | 19.6,33.5 19.6,34.5 | 9.2,74.1 7.9,74.1 X1.B26 | 76.6,31.6 76.6,32.4 | 76.6,60.9 76.6,62.1
DB3  (3 unrouted)
  Bottom 0.23: 29.1,21.8 29.2,21.7 32.3,21.7 32.4,21.8 | 57,28.7 57.1,28.8 60.3,28.8 60.4,28.7
  Bottom 0.3: IC1.8 15.7,45.5 20.6,45.5 | 20.6,20.6 22.8,20.6 24.2,22 28.9,22 29.1,21.8 | X1.A26 5.43,74.13 | 20.6,66.8 20.6,70.2 17.1,73.7 11.1,73.7 9.4,75.4 6.7,75.4 | 20.6,44.7 20.6,43.8 | 81.1,48.2 81.1,40.8 81.7,40.2 81.7,33.8 75.68,27.78 IC3.15 74.05,27.8 73,27.8 70.3,30.5 63.8,30.5 62,28.7 60.4,28.7 | 81.1,62.5 82.8,62.5 83.5,61.8 97.1,61.8 98.3,63 100.64,63 IC5.40 | 32.4,21.8 33,22.4 38,22.4 45.2,29.6 49.9,29.6 51.72,27.78 IC2.17 53.28,27.78 54.2,28.7 57,28.7
  Bottom 0.5: 5.43,74.13 6.7,75.4
  Bottom 0.8: 20.6,45.5 20.6,44.7 | 20.6,20.6 20.6,21.3 | 20.6,66.8 20.6,65.8 | 20.6,43.8 20.6,43.3 | 81.1,48.2 81.1,49.2 | 81.1,61.6 81.1,62.5
DB4  (3 unrouted)
  Bottom 0.23: 57.1,29.4 57.2,29.3 60.2,29.3 60.4,29.5
  Bottom 0.3: 21.6,49 21.6,49.5 | 21.6,49.5 21.6,50 | IC1.7 18.2,48.1 19.6,49.5 21.6,49.5 | 21.6,69 21.6,70.3 17.5,74.4 11.6,74.4 9.3,76.7 | 80.1,45.5 80.1,40.7 81,39.8 81,34.2 77.12,30.32 IC3.16 73.99,30.4 71.6,30.4 70.7,31.3 63.6,31.3 61.8,29.5 60.4,29.5 | 80.1,59.6 83,59.6 83.4,59.2 97,59.2 98.3,60.5 100.68,60.5 IC5.39 | 21.6,23.4 28.8,23.4 29.3,23.9 32.3,23.9 33.1,23.1 37.7,23.1 44.92,30.32 IC2.18 53.98,30.32 54.9,29.4 57.1,29.4
  Bottom 0.8: 21.6,49 21.6,48.2 | 21.6,24.1 21.6,23.4 21.6,23.3 | 21.6,50 21.6,51 | 21.6,69 21.6,68 | 9.3,76.7 7.9,76.7 X1.B27 | 80.1,45.5 80.1,46.7 | 80.1,58.7 80.1,59.6
DB5  (3 unrouted)
  Bottom 0.23: 32.5,31.9 32.4,31.8 29.4,31.8 29.3,31.9
  Bottom 0.3: 23.6,28 25.7,28 26.8,29.1 26.8,30.6 28.1,31.9 29.3,31.9 | IC1.9 17.52,43.02 18.1,42.4 19.7,40.8 22,40.8 23.6,42.4 | X1.A27 5.37,76.67 | 23.6,66.9 23.6,69.5 17.9,75.1 12.3,75.1 9.5,77.9 6.6,77.9 | 79.2,42.7 79.2,40.5 80.3,39.4 80.3,34.6 79.1,33.4 75.7,33.4 75.16,32.86 IC3.17 74.03,32.9 62.8,32.9 61.5,31.6 55,31.6 53.74,32.86 IC2.19 41.76,32.86 40.5,31.6 35.7,31.6 35.2,32.1 32.7,32.1 32.5,31.9 | 79.2,56.5 83.3,56.5 83.5,56.7 97.1,56.7 98.4,58 IC5.38 | 23.6,43.1 23.6,44.1
  Bottom 0.5: 5.37,76.67 6.6,77.9
  Bottom 0.8: 23.6,42.4 23.6,43.1 | 23.6,28 23.6,29 | 23.6,66.9 23.6,65.9 | 79.2,42.7 79.2,44 | 79.2,55.6 79.2,56.5 | 23.6,44.1 23.6,44.8
DB6  (3 unrouted)
  Bottom 0.23: 29.1,34.5 29.2,34.4 32.7,34.4
  Bottom 0.3: IC1.10 17.22,40.48 19.7,38 24.5,38 24.6,37.9 | 24.6,69 24.6,69.5 18.3,75.8 12.7,75.8 9.3,79.2 9.1,79.2 | 24.6,32.3 25.5,32.3 27.7,34.5 29.1,34.5 | 24.6,38.5 24.6,37.9 | 24.6,37.9 24.6,37.4 | 77.6,35.4 IC3.18 62.7,35.4 61.4,34.1 55.2,34.1 53.9,35.4 IC2.20 41.4,35.4 40.1,34.1 33.2,34.1 32.9,34.4 32.7,34.4 | IC5.3 85.3,57.9 83.7,57.9 83.4,57.6 78.7,57.6 78.1,57 77.6,57
  Bottom 0.8: 24.6,39.5 24.6,38.5 | 24.6,33.1 24.6,32.3 | 24.6,69 24.6,68 | 9.1,79.2 X1.B28 | 24.6,37.4 24.6,36.4 | 77.6,35.4 77.6,36.4 | 77.6,56 77.6,57
DB7  (2 unrouted)
  Bottom 0.23: 32.5,37 32.4,36.9 29.2,36.9 29.1,37
  Bottom 0.3: X1.A28 5.41,79.21 | IC1.13 17.14,32.86 17.5,32.5 21.8,32.5 24,34.7 25.9,34.7 28.2,37 | 28.2,37 28.2,37.5 | 6.7,80.5 9.1,80.5 13.1,76.5 18.6,76.5 25.2,69.9 27.4,69.9 28.2,70.8 | 78.3,40.5 75.74,37.94 IC3.19 74.03,37.9 62.7,37.9 61.4,36.6 55.2,36.6 53.86,37.94 IC2.21 41.24,37.94 40,36.7 35.6,36.7 35.3,37 32.5,37 | IC5.2 80.67,60.53 80.3,60.9 79.1,60.9 78.3,60.1 | 29.1,37 28.2,37
  Bottom 0.5: 5.41,79.21 6.7,80.5
  Bottom 0.8: 28.2,71.8 28.2,70.8 | 28.2,37.5 28.2,38.5 | 78.3,60.1 78.3,59 | 78.3,40.5 78.3,41.5
GND  (via drill 0.5 pad 1.5)  (3 unrouted)
  Bottom 0.3: 45.9,88.5 48.6,88.5
  other vias: 37.2,72.4 19.6,78.2 55.8,25.9 36.1,24.8 67.9,69.1 105.6,23.5 105.6,15 81.8,89.3 48,91.3 32.8,66 117.6,18.4
  pour Top: 0,100 160,100 160,0 0,0
  pour Bottom (isolate 0.33, rank 6): 0,100 160,100 160,0 0,0
  pour Bottom (rank 6, no thermals): 155.35,71.12 145.19,71.12 145.19,8.54 155.35,8.54
  pour Bottom (rank 6, no thermals): 134.6,71 143.6,71 143.6,12 135.6,12 135.6,54 134.6,54
  pour Bottom (rank 6, no thermals): 3.6,94.8 10.1,94.8 10.1,91.4 3.6,91.4
  pour Bottom (rank 6, no thermals): 0,91.1 3.7,91.1 3.7,87.7 0,87.7
GND1
  pour Bottom (rank 6, no thermals): 5.6,8.5 12.1,8.5 12.1,4.5 5.6,4.5
N$1  (1 unrouted)
  Bottom 0.3: IC7.11 45.44,82.16 47,80.6 47,79 46.3,78.3 43,78.3 41.6,76.9 41.6,70.8 42,70.4 54.8,70.4 55.6,69.6 55.6,69.4 | 55.6,39.4 56.8,39.4 57,39.2 61.8,39.2 63.1,40.5 74.05,40.5 IC3.20
  Bottom 0.8: 55.6,69.4 55.6,68.4 | 55.6,40.5 55.6,39.4
N$2
  Bottom 0.3: IC9.2 50.94,87.2 50.1,87.2 46.3,83.4 40.8,83.4 39.5,84.7 IC7.3
N$3  (1 unrouted)
  Bottom 0.3: 43.9,40.5 52.46,40.5 IC2.22 | 43.9,72.4 43.9,73.45 IC7.8
  Bottom 0.8: 43.9,72.4 43.9,71.4 | 43.9,41.3 43.9,40.5
N$4
  Bottom 0.3: IC9.8 56.57,74.53 54.8,76.3 54.8,77.8 53,79.6 IC9.5
N$5
  Bottom 0.3: IC9.6 50.23,77.07 49,78.3 49,80.1 49.9,81 52.4,81 53.3,81.9 53.3,89 52.5,89.8 51,89.8 IC9.1
N$6  (1 unrouted)
  Bottom 0.3: IC7.9 46.38,77.08 47.7,78.4 47.7,83.4 49,84.7 IC9.3
N$7
  Bottom 0.3: IC7.2 38.24,87.24 39.5,88.5 39.5,90.5 38.8,91.2 36.3,91.2 32.4,87.3 31.31,87.3 IC4.13
N$8
  Bottom 0.3: IC7.6 37.29,77 35.5,77 34.6,77.9 34.6,87.8 36.6,89.8 37.35,89.8 IC7.1
N$9
  Bottom 0.5: R12.1 92.1,85.33 LED1.A
N$10
  Bottom 0.5: IC6.15 122.34,30.05 SV1.1
N$11
  Bottom 0.3: IC8.10 IC8.11
N$12
  Bottom 0.5: IC8.9 73.94,77.06 72.8,78.2 R4.2
N$13
  Bottom 0.5: R5.1 78.35,87.22 IC8.13
N$14  (1 unrouted)
  Bottom 0.3: IC6.1 114.31,32.59 117.3,29.6 117.3,21.1 114.8,18.6 111.5,18.6 111.2,18.3 107.9,18.3 106.9,19.3 104.4,19.3 102.5,21.2 99.3,21.2 98.7,20.6 96.7,20.6 87.4,29.9 85.62,29.9 IC5.14
N$15  (1 unrouted)
  Bottom 0.3: IC6.2 115.45,30.05 116.5,29 116.5,21.9 115.7,21.1 104.7,21.1 102.1,23.7 99.2,23.7 98.6,23.1 98.6,21.9 98.1,21.4 96.9,21.4 87.8,30.5 87.8,31.7 87,32.5 85.56,32.5 IC5.13
N$16  (1 unrouted)
  Bottom 0.3: IC6.3 111.89,27.51 110.6,28.8 99.4,28.8 93.2,35 85.6,35 IC5.12
N$17
  Bottom 0.3: IC8.5 IC8.4 IC8.3
N$18
  Bottom 0.5: IC6.14 122.34,27.51 SV1.3
N$19
  Bottom 0.3: IC9.11 57.75,82.15 56.3,83.6 56.3,87.7 57.1,88.5 60.2,88.5 62.4,86.3 62.4,79.2 63.9,77.7 63.9,58 64.6,57.3 64.6,55.1 66.4,53.3 68,53.3 71.7,57 75.2,57 78.1,54.1 82.6,54.1 83.8,55.4 85.42,55.4 IC5.4
N$20
  Bottom 0.3: IC8.6 68.41,77.1 70.3,77.1 76.3,71.1 87,71.1 93.2,64.9 102,64.9 103.2,63.7 103.2,56.5 102.15,55.45 IC5.37
N$21
  Bottom 0.5: IC6.13 122.34,24.97 SV1.5
N$22
  Bottom 0.5: IC6.12 122.34,22.43 SV1.7
N$23
  Bottom 0.5: IC6.11 122.34,19.89 SV1.9
N$24
  Bottom 0.5: IC6.10 122.34,17.35 SV1.11
N$25
  Bottom 0.5: IC6.9 122.34,14.81 SV1.13
N$26
  Bottom 0.5: IC6.7 113.46,17.3 115.6,17.3 118.1,14.8 118.1,14.4 119.1,13.4 123.47,13.4 SV1.15
N$27
  Bottom 0.3: IC5.27 RN2.2 | SV1.2 127.38,33.52 126.3,34.6 109.6,34.6 108,33 108,31.5 106.6,30.1 105.84,30.1 RN2.2 | 105.84,30 RN2.2
N$28
  Bottom 0.3: IC5.28 RN2.3 106.6,32.6 109.3,35.3 126.7,35.3 129,33 129,31.2 127.81,30.01 SV1.4
N$29
  Bottom 0.3: IC5.29 RN2.4 105.82,35.1 108.1,35.1 109,36 127,36 129.7,33.3 129.7,29.8 SV1.6
N$30
  Bottom 0.3: IC5.30 RN2.5 105.82,37.7 107.7,37.7 108.7,36.7 127.3,36.7 130.4,33.6 130.4,27 128.33,24.93 SV1.8
N$31
  Bottom 0.3: IC5.31 RN2.6 107.3,40.2 107.7,39.8 107.7,38.8 109.1,37.4 127.6,37.4 131.1,33.9 131.1,26.1 SV1.10
N$32
  Bottom 0.3: IC5.32 RN2.7 105.84,42.7 107.4,42.7 108.5,41.6 108.5,39.1 109.5,38.1 127.9,38.1 131.8,34.2 131.8,24.2 127.38,19.88 SV1.12
N$33
  Bottom 0.3: IC5.33 RN2.8 107.5,45.3 109.2,43.6 109.2,39.5 109.9,38.8 128.2,38.8 132.5,34.5 132.5,22.4 127.41,17.31 SV1.14
N$34
  Bottom 0.3: IC5.34 RN2.9 105.82,47.8 107.5,47.8 109.9,45.4 109.9,39.9 110.3,39.5 128.5,39.5 133.2,34.8 133.2,20.6 SV1.16
N$35
  Bottom 0.23: 98.8,54.4 102.5,54.4
  Bottom 0.3: IC5.9 84.25,42.75 83.3,43.7 83.3,48.2 84.2,49.1 92.7,49.1 98,54.4 98.8,54.4 | JP3.1 127.46,69.5 129.4,69.5 129.9,69 129.9,59.8 129.3,59.2 125.9,59.2 125.2,59.9 107.4,59.9 103.9,56.4 103.9,55.5 102.8,54.4 102.5,54.4
N$36
  Bottom 0.3: IC10.3 81.67,77.23 79.7,79.2 79.7,83.7 81.7,85.7 85.61,85.7 T1.2
N$37
  Bottom 0.5: IC10.6 IC10.7 89.38,79.8 88.2,79.8 87.65,80.35 R7.1 87.05,80.5 86.7,80.5 86.2,81 C3.1
N$38
  Bottom 0.5: C4.1 90.7,74.3 90.3,74.7 IC10.5
N$39
  Bottom 0.8: JP3.2 122.78,66.88 R6.1
N$40
  Bottom 0.3: IC5.24 102.27,22.43 104.6,20.1 107.4,20.1 107.8,19.7
  Bottom 0.5: 107.8,19.7 R10.1
  Bottom 0.8: IC6.6 109.5,19.89 R10.1
N$41  (via drill 0.8 pad 1.8)
  other vias: 44.86,17.78
N$42  (via drill 0.8 pad 1.8)
  other vias: 47.4,17.78
N$43  (via drill 0.8 pad 1.8)
  other vias: 49.94,17.78
N$44  (via drill 0.8 pad 1.8)
  other vias: 52.48,17.78
N$45  (via drill 0.8 pad 1.8)
  other vias: 55.02,17.78
N$46  (via drill 0.8 pad 1.8)
  other vias: 57.56,17.78
N$47  (via drill 0.8 pad 1.8)
  other vias: 60.1,17.78
N$48  (via drill 0.8 pad 1.8)
  other vias: 62.64,17.78
N$49  (via drill 0.8 pad 1.8)
  other vias: 65.18,17.78
N$50  (via drill 0.8 pad 1.8)
  other vias: 67.72,17.78
N$51  (via drill 0.8 pad 1.8)
  other vias: 70.26,17.78
N$52  (via drill 0.8 pad 1.8)
  other vias: 72.8,17.78
N$53  (via drill 0.8 pad 1.8)
  other vias: 75.34,17.78
N$54  (via drill 0.8 pad 1.8)
  other vias: 75.34,15.24
N$55  (via drill 0.8 pad 1.8)
  other vias: 72.8,15.24
N$56  (via drill 0.8 pad 1.8)
  other vias: 70.26,15.24
N$57  (via drill 0.8 pad 1.8)
  other vias: 67.72,15.24
N$58  (via drill 0.8 pad 1.8)
  other vias: 65.18,15.24
N$59  (via drill 0.8 pad 1.8)
  other vias: 62.64,15.24
N$60  (via drill 0.8 pad 1.8)
  other vias: 60.1,15.24
N$61  (via drill 0.8 pad 1.8)
  other vias: 57.56,15.24
N$62  (via drill 0.8 pad 1.8)
  other vias: 55.02,15.24
N$63  (via drill 0.8 pad 1.8)
  other vias: 52.48,15.24
N$64  (via drill 0.8 pad 1.8)
  other vias: 49.94,15.24
N$65  (via drill 0.8 pad 1.8)
  other vias: 47.4,15.24
N$66  (via drill 0.8 pad 1.8)
  other vias: 44.86,15.24
N$67  (via drill 0.8 pad 1.8)
  other vias: 44.86,12.7
N$68  (via drill 0.8 pad 1.8)
  other vias: 47.4,12.7
N$69  (via drill 0.8 pad 1.8)
  other vias: 49.94,12.7
N$70  (via drill 0.8 pad 1.8)
  other vias: 52.48,12.7
N$71  (via drill 0.8 pad 1.8)
  other vias: 55.02,12.7
N$72  (via drill 0.8 pad 1.8)
  other vias: 57.56,12.7
N$73  (via drill 0.8 pad 1.8)
  other vias: 60.1,12.7
N$74  (via drill 0.8 pad 1.8)
  other vias: 62.64,12.7
N$75  (via drill 0.8 pad 1.8)
  other vias: 65.18,12.7
N$76  (via drill 0.8 pad 1.8)
  other vias: 67.72,12.7
N$77  (via drill 0.8 pad 1.8)
  other vias: 70.26,12.7
N$78  (via drill 0.8 pad 1.8)
  other vias: 72.8,12.7
N$79  (via drill 0.8 pad 1.8)
  other vias: 75.34,12.7
N$80  (via drill 0.8 pad 1.8)
  other vias: 75.34,10.16
N$81  (via drill 0.8 pad 1.8)
  other vias: 72.8,10.16
N$82  (via drill 0.8 pad 1.8)
  other vias: 70.26,10.16
N$83  (via drill 0.8 pad 1.8)
  other vias: 67.72,10.16
N$84  (via drill 0.8 pad 1.8)
  other vias: 65.18,10.16
N$85  (via drill 0.8 pad 1.8)
  other vias: 62.64,10.16
N$86  (via drill 0.8 pad 1.8)
  other vias: 60.1,10.16
N$87  (via drill 0.8 pad 1.8)
  other vias: 57.56,10.16
N$88  (via drill 0.8 pad 1.8)
  other vias: 55.02,10.16
N$89  (via drill 0.8 pad 1.8)
  other vias: 52.48,10.16
N$90  (via drill 0.8 pad 1.8)
  other vias: 49.94,10.16
N$91  (via drill 0.8 pad 1.8)
  other vias: 47.4,10.16
N$92  (via drill 0.8 pad 1.8)
  other vias: 44.86,10.16
N$93  (via drill 0.8 pad 1.8)
  other vias: 44.86,7.62
N$94  (via drill 0.8 pad 1.8)
  other vias: 47.4,7.62
N$95  (via drill 0.8 pad 1.8)
  other vias: 49.94,7.62
N$96  (via drill 0.8 pad 1.8)
  other vias: 52.48,7.62
N$97  (via drill 0.8 pad 1.8)
  other vias: 55.02,7.62
N$98  (via drill 0.8 pad 1.8)
  other vias: 57.56,7.62
N$99  (via drill 0.8 pad 1.8)
  other vias: 60.1,7.62
N$100  (via drill 0.8 pad 1.8)
  other vias: 62.64,7.62
N$101  (via drill 0.8 pad 1.8)
  other vias: 65.18,7.62
N$102  (via drill 0.8 pad 1.8)
  other vias: 67.72,7.62
N$103  (via drill 0.8 pad 1.8)
  other vias: 70.26,7.62
N$104  (via drill 0.8 pad 1.8)
  other vias: 72.8,7.62
N$105  (via drill 0.8 pad 1.8)
  other vias: 75.34,7.62
N$106  (via drill 0.8 pad 1.8)
  other vias: 75.34,5.08
N$107  (via drill 0.8 pad 1.8)
  other vias: 72.8,5.08
N$108  (via drill 0.8 pad 1.8)
  other vias: 70.26,5.08
N$109  (via drill 0.8 pad 1.8)
  other vias: 67.72,5.08
N$110  (via drill 0.8 pad 1.8)
  other vias: 65.18,5.08
N$111  (via drill 0.8 pad 1.8)
  other vias: 62.64,5.08
N$112  (via drill 0.8 pad 1.8)
  other vias: 60.1,5.08
N$113  (via drill 0.8 pad 1.8)
  other vias: 57.56,5.08
N$114  (via drill 0.8 pad 1.8)
  other vias: 55.02,5.08
N$115  (via drill 0.8 pad 1.8)
  other vias: 52.48,5.08
N$116  (via drill 0.8 pad 1.8)
  other vias: 49.94,5.08
N$117  (via drill 0.8 pad 1.8)
  other vias: 47.4,5.08
N$118  (via drill 0.8 pad 1.8)
  other vias: 44.86,5.08
N$119  (via drill 0.8 pad 1.8)
  other vias: 75.34,10.16
N$120  (via drill 0.8 pad 1.8)
  other vias: 77.88,10.16
N$121  (via drill 0.8 pad 1.8)
  other vias: 80.42,10.16
N$122  (via drill 0.8 pad 1.8)
  other vias: 82.96,10.16
N$123  (via drill 0.8 pad 1.8)
  other vias: 85.5,10.16
N$124  (via drill 0.8 pad 1.8)
  other vias: 88.04,10.16
N$125  (via drill 0.8 pad 1.8)
  other vias: 90.58,10.16
N$126  (via drill 0.8 pad 1.8)
  other vias: 93.12,10.16
N$127  (via drill 0.8 pad 1.8)
  other vias: 95.66,10.16
N$128  (via drill 0.8 pad 1.8)
  other vias: 98.2,10.16
N$129  (via drill 0.8 pad 1.8)
  other vias: 100.74,10.16
N$130  (via drill 0.8 pad 1.8)
  other vias: 103.28,10.16
N$131  (via drill 0.8 pad 1.8)
  other vias: 105.82,10.16
N$132  (via drill 0.8 pad 1.8)
  other vias: 105.82,7.62
N$133  (via drill 0.8 pad 1.8)
  other vias: 103.28,7.62
N$134  (via drill 0.8 pad 1.8)
  other vias: 100.74,7.62
N$135  (via drill 0.8 pad 1.8)
  other vias: 98.2,7.62
N$136  (via drill 0.8 pad 1.8)
  other vias: 95.66,7.62
N$137  (via drill 0.8 pad 1.8)
  other vias: 93.12,7.62
N$138  (via drill 0.8 pad 1.8)
  other vias: 90.58,7.62
N$139  (via drill 0.8 pad 1.8)
  other vias: 88.04,7.62
N$140  (via drill 0.8 pad 1.8)
  other vias: 85.5,7.62
N$141  (via drill 0.8 pad 1.8)
  other vias: 82.96,7.62
N$142  (via drill 0.8 pad 1.8)
  other vias: 80.42,7.62
N$143  (via drill 0.8 pad 1.8)
  other vias: 77.88,7.62
N$144  (via drill 0.8 pad 1.8)
  other vias: 75.34,7.62
N$145  (via drill 0.8 pad 1.8)
  other vias: 77.88,5.08
N$146  (via drill 0.8 pad 1.8)
  other vias: 80.42,5.08
N$147  (via drill 0.8 pad 1.8)
  other vias: 82.96,5.08
N$148  (via drill 0.8 pad 1.8)
  other vias: 85.5,5.08
N$149  (via drill 0.8 pad 1.8)
  other vias: 88.04,5.08
N$150  (via drill 0.8 pad 1.8)
  other vias: 90.58,5.08
N$151  (via drill 0.8 pad 1.8)
  other vias: 93.12,5.08
N$152  (via drill 0.8 pad 1.8)
  other vias: 95.66,5.08
N$153  (via drill 0.8 pad 1.8)
  other vias: 98.2,5.08
N$154  (via drill 0.8 pad 1.8)
  other vias: 100.74,5.08
N$155  (via drill 0.8 pad 1.8)
  other vias: 103.28,5.08
N$156  (via drill 0.8 pad 1.8)
  other vias: 105.82,5.08
N$157  (via drill 0.8 pad 1.8)  (2 unrouted)
  other vias: 108.36,5.08 108.36,7.62 108.36,10.16
N$158  (via drill 0.8 pad 1.8)
  other vias: 108.36,2.54
N$159  (via drill 0.8 pad 1.8)
  other vias: 105.82,2.54
N$160  (via drill 0.8 pad 1.8)
  other vias: 103.28,2.54
N$161  (via drill 0.8 pad 1.8)
  other vias: 100.74,2.54
N$162  (via drill 0.8 pad 1.8)
  other vias: 98.2,2.54
N$163  (via drill 0.8 pad 1.8)
  other vias: 95.66,2.54
N$164  (via drill 0.8 pad 1.8)
  other vias: 93.12,2.54
N$165  (via drill 0.8 pad 1.8)
  other vias: 90.58,2.54
N$166  (via drill 0.8 pad 1.8)
  other vias: 88.04,2.54
N$167  (via drill 0.8 pad 1.8)
  other vias: 85.5,2.54
N$168  (via drill 0.8 pad 1.8)
  other vias: 82.96,2.54
N$169  (via drill 0.8 pad 1.8)
  other vias: 80.42,2.54
N$170  (via drill 0.8 pad 1.8)
  other vias: 77.88,2.54
N$171  (via drill 0.8 pad 1.8)
  other vias: 75.34,2.54
N$172  (via drill 0.8 pad 1.8)
  other vias: 72.8,2.54
N$173  (via drill 0.8 pad 1.8)
  other vias: 70.26,2.54
N$174  (via drill 0.8 pad 1.8)
  other vias: 67.72,2.54
N$175  (via drill 0.8 pad 1.8)
  other vias: 65.18,2.54
N$176  (via drill 0.8 pad 1.8)
  other vias: 62.64,2.54
N$177  (via drill 0.8 pad 1.8)
  other vias: 60.1,2.54
N$178  (via drill 0.8 pad 1.8)
  other vias: 57.56,2.54
N$179  (via drill 0.8 pad 1.8)
  other vias: 55.02,2.54
N$180  (via drill 0.8 pad 1.8)
  other vias: 52.48,2.54
N$181  (via drill 0.8 pad 1.8)
  other vias: 49.94,2.54
N$182  (via drill 0.8 pad 1.8)
  other vias: 47.4,2.54
N$183  (via drill 0.8 pad 1.8)
  other vias: 44.86,2.54
N$184  (via drill 0.8 pad 1.8)
  other vias: 42.32,15.24
N$185  (via drill 0.8 pad 1.8)
  other vias: 39.78,15.24
N$186  (1 unrouted)
  Bottom 0.3: IC7.12 42.9,84.7 42.8,84.8 | 42.8,97.5 29.7,97.5 23.7,91.5 23.7,89.85 IC4.1
  Bottom 0.8: 42.8,84.8 42.8,85.8 | 42.8,96.4 42.8,97.5
N$187  (via drill 0.8 pad 1.8)
  other vias: 37.24,12.7
N$188  (via drill 0.8 pad 1.8)
  other vias: 39.78,12.7
N$189  (via drill 0.8 pad 1.8)
  other vias: 42.32,12.7
N$190  (via drill 0.8 pad 1.8)
  other vias: 42.32,10.16
N$191  (via drill 0.8 pad 1.8)
  other vias: 39.78,10.16
N$192  (via drill 0.8 pad 1.8)
  other vias: 37.24,10.16
N$193  (via drill 0.8 pad 1.8)
  other vias: 37.24,7.62
N$194  (via drill 0.8 pad 1.8)
  other vias: 39.78,7.62
N$195  (via drill 0.8 pad 1.8)
  other vias: 42.32,7.62
N$196  (via drill 0.8 pad 1.8)
  other vias: 42.32,5.08
N$197  (via drill 0.8 pad 1.8)
  other vias: 39.78,5.08
N$198  (via drill 0.8 pad 1.8)
  other vias: 37.24,5.08
N$199  (via drill 0.8 pad 1.8)
  other vias: 42.32,2.54
N$200  (via drill 0.8 pad 1.8)
  other vias: 39.78,2.54
N$201  (via drill 0.8 pad 1.8)
  other vias: 37.24,2.54
N$202  (via drill 0.8 pad 1.8)
  other vias: 34.7,10.16
N$203  (via drill 0.8 pad 1.8)
  other vias: 32.16,10.16
N$204  (via drill 0.8 pad 1.8)
  other vias: 32.16,7.62
N$205  (via drill 0.8 pad 1.8)
  other vias: 34.7,7.62
N$206  (via drill 0.8 pad 1.8)
  other vias: 34.7,5.08
N$207  (via drill 0.8 pad 1.8)
  other vias: 32.16,5.08
N$208  (via drill 0.8 pad 1.8)
  other vias: 34.7,2.54
N$209  (via drill 0.8 pad 1.8)
  other vias: 32.16,2.54
N$210  (via drill 0.8 pad 1.8)
  other vias: 29.62,10.16
N$211  (via drill 0.8 pad 1.8)
  other vias: 27.08,10.16
N$212  (via drill 0.8 pad 1.8)
  other vias: 24.54,10.16
N$213  (via drill 0.8 pad 1.8)
  other vias: 24.54,7.62
N$214  (via drill 0.8 pad 1.8)
  other vias: 27.08,7.62
N$215  (via drill 0.8 pad 1.8)
  other vias: 29.62,7.62
N$216  (via drill 0.8 pad 1.8)
  other vias: 29.62,5.08
N$217  (via drill 0.8 pad 1.8)
  other vias: 27.08,5.08
N$218  (via drill 0.8 pad 1.8)
  other vias: 24.54,5.08
N$219  (via drill 0.8 pad 1.8)
  other vias: 29.62,2.54
N$220  (via drill 0.8 pad 1.8)
  other vias: 27.08,2.54
N$221  (via drill 0.8 pad 1.8)
  other vias: 24.54,2.54
N$222  (via drill 0.8 pad 1.8)
  other vias: 110.9,10.16
N$223  (via drill 0.8 pad 1.8)
  other vias: 113.44,10.16
N$224  (via drill 0.8 pad 1.8)
  other vias: 115.98,10.16
N$225  (via drill 0.8 pad 1.8)
  other vias: 118.52,10.16
N$226  (via drill 0.8 pad 1.8)
  other vias: 121.06,10.16
N$227  (via drill 0.8 pad 1.8)
  other vias: 123.6,10.16
N$228  (via drill 0.8 pad 1.8)
  other vias: 126.14,10.16
N$229  (via drill 0.8 pad 1.8)
  other vias: 128.68,10.16
N$230  (via drill 0.8 pad 1.8)
  other vias: 131.22,10.16
N$231  (via drill 0.8 pad 1.8)
  other vias: 133.76,10.16
N$232  (via drill 0.8 pad 1.8)
  other vias: 136.3,10.16
N$233  (via drill 0.8 pad 1.8)
  other vias: 136.3,7.62
N$234  (via drill 0.8 pad 1.8)
  other vias: 133.76,7.62
N$235  (via drill 0.8 pad 1.8)
  other vias: 131.22,7.62
N$236  (via drill 0.8 pad 1.8)
  other vias: 128.68,7.62
N$237  (via drill 0.8 pad 1.8)
  other vias: 126.14,7.62
N$238  (via drill 0.8 pad 1.8)
  other vias: 123.6,7.62
N$239  (via drill 0.8 pad 1.8)
  other vias: 121.06,7.62
N$240  (via drill 0.8 pad 1.8)
  other vias: 118.52,7.62
N$241  (via drill 0.8 pad 1.8)
  other vias: 115.98,7.62
N$242  (via drill 0.8 pad 1.8)
  other vias: 113.44,7.62
N$243  (via drill 0.8 pad 1.8)
  other vias: 110.9,7.62
N$244  (via drill 0.8 pad 1.8)
  other vias: 110.9,5.08
N$245  (via drill 0.8 pad 1.8)
  other vias: 113.44,5.08
N$246  (via drill 0.8 pad 1.8)
  other vias: 115.98,5.08
N$247  (via drill 0.8 pad 1.8)
  other vias: 118.52,5.08
N$248  (via drill 0.8 pad 1.8)
  other vias: 121.06,5.08
N$249  (via drill 0.8 pad 1.8)
  other vias: 123.6,5.08
N$250  (via drill 0.8 pad 1.8)
  other vias: 126.14,5.08
N$251  (via drill 0.8 pad 1.8)
  other vias: 128.68,5.08
N$252  (via drill 0.8 pad 1.8)
  other vias: 131.22,5.08
N$253  (via drill 0.8 pad 1.8)
  other vias: 133.76,5.08
N$254  (via drill 0.8 pad 1.8)
  other vias: 136.3,5.08
N$255  (via drill 0.8 pad 1.8)  (5 unrouted)
  other vias: 138.84,5.08 138.84,7.62 138.84,10.16 141.38,10.16 141.38,7.62 141.38,5.08
N$256  (via drill 0.8 pad 1.8)  (1 unrouted)
  other vias: 138.84,2.54 141.38,2.54
N$257  (via drill 0.8 pad 1.8)
  other vias: 136.3,2.54
N$258  (via drill 0.8 pad 1.8)
  other vias: 133.76,2.54
N$259  (via drill 0.8 pad 1.8)
  other vias: 131.22,2.54
N$260  (via drill 0.8 pad 1.8)
  other vias: 128.68,2.54
N$261  (via drill 0.8 pad 1.8)
  other vias: 126.14,2.54
N$262  (via drill 0.8 pad 1.8)
  other vias: 123.6,2.54
N$263  (via drill 0.8 pad 1.8)
  other vias: 121.06,2.54
N$264  (via drill 0.8 pad 1.8)
  other vias: 118.52,2.54
N$265  (via drill 0.8 pad 1.8)
  other vias: 115.98,2.54
N$266  (via drill 0.8 pad 1.8)
  other vias: 113.44,2.54
N$267  (via drill 0.8 pad 1.8)
  other vias: 110.9,2.54
N$268  (via drill 0.8 pad 3)
  other vias: 155,95
N$271  (via drill 0.8 pad 1.8)
  other vias: 146.46,96.52
N$272  (via drill 0.8 pad 1.8)
  other vias: 143.92,96.52
N$273  (via drill 0.8 pad 1.8)
  other vias: 143.92,93.98
N$274  (via drill 0.8 pad 1.8)
  other vias: 146.46,93.98
N$275  (via drill 0.8 pad 3)
  other vias: 155,5
N$276  (2 unrouted)
N$277  (via drill 0.8 pad 1.8)
  other vias: 118.52,78.74
N$278  (via drill 0.8 pad 1.8)
  other vias: 115.98,78.74
N$279  (via drill 0.8 pad 1.8)
  other vias: 113.44,78.74
N$280  (via drill 0.8 pad 1.8)
  other vias: 110.9,78.74
N$281  (via drill 0.8 pad 1.8)
  other vias: 108.36,78.74
N$282  (via drill 0.8 pad 1.8)
  other vias: 105.82,78.74
N$283  (1 unrouted)
N$284  (1 unrouted)
N$285  (1 unrouted)
N$286  (1 unrouted)
N$287  (1 unrouted)
N$288  (1 unrouted)
N$289  (via drill 0.8 pad 1.8)
  other vias: 105.82,76.2
N$290  (via drill 0.8 pad 1.8)
  other vias: 108.36,76.2
N$291  (via drill 0.8 pad 1.8)
  other vias: 110.9,76.2
N$292  (via drill 0.8 pad 1.8)
  other vias: 113.44,76.2
N$293  (via drill 0.8 pad 1.8)
  other vias: 115.98,76.2
N$294  (via drill 0.8 pad 1.8)
  other vias: 118.52,76.2
N$295  (via drill 0.8 pad 1.8)
  other vias: 118.52,73.66
N$296  (via drill 0.8 pad 1.8)
  other vias: 115.98,73.66
N$297  (via drill 0.8 pad 1.8)
  other vias: 113.44,73.66
N$298  (via drill 0.8 pad 1.8)
  other vias: 110.9,73.66
N$299  (via drill 0.8 pad 1.8)
  other vias: 108.36,73.66
N$300  (via drill 0.8 pad 1.8)
  other vias: 105.82,73.66
N$301  (1 unrouted)
N$302  (1 unrouted)
N$307  (via drill 0.8 pad 1.8)
  other vias: 105.82,71.12
N$308  (via drill 0.8 pad 1.8)
  other vias: 108.36,71.12
N$309  (via drill 0.8 pad 1.8)
  other vias: 110.9,71.12
N$310  (via drill 0.8 pad 1.8)
  other vias: 113.44,71.12
N$311  (via drill 0.8 pad 1.8)
  other vias: 115.98,71.12
N$312  (via drill 0.8 pad 1.8)
  other vias: 118.52,71.12
N$313  (via drill 0.8 pad 1.8)
  other vias: 118.52,68.58
N$314  (via drill 0.8 pad 1.8)
  other vias: 115.98,68.58
N$315  (via drill 0.8 pad 1.8)
  other vias: 113.44,68.58
N$316  (via drill 0.8 pad 1.8)
  other vias: 110.9,68.58
N$317  (via drill 0.8 pad 1.8)
  other vias: 108.36,68.58
N$318  (via drill 0.8 pad 1.8)
  other vias: 105.82,68.58
N$322  (via drill 0.8 pad 1.8)
  other vias: 118.52,96.52
N$323  (via drill 0.8 pad 1.8)
  other vias: 115.98,96.52
N$324  (via drill 0.8 pad 1.8)
  other vias: 113.44,96.52
N$325  (via drill 0.8 pad 1.8)
  other vias: 110.9,96.52
N$326  (via drill 0.8 pad 1.8)
  other vias: 108.36,96.52
N$327  (via drill 0.8 pad 1.8)
  other vias: 105.82,96.52
N$328  (via drill 0.8 pad 1.8)
  other vias: 103.28,96.52
N$329  (via drill 0.8 pad 1.8)
  other vias: 100.74,96.52
N$330  (via drill 0.8 pad 1.8)
  other vias: 98.2,96.52
N$331  (via drill 0.8 pad 1.8)
  other vias: 98.2,93.98
N$332  (via drill 0.8 pad 1.8)
  other vias: 100.74,93.98
N$333  (via drill 0.8 pad 1.8)
  other vias: 103.28,93.98
N$334  (via drill 0.8 pad 1.8)
  other vias: 105.82,93.98
N$335  (via drill 0.8 pad 1.8)
  other vias: 108.36,93.98
N$336  (via drill 0.8 pad 1.8)
  other vias: 110.9,93.98
N$337  (via drill 0.8 pad 1.8)
  other vias: 113.44,93.98
N$338  (via drill 0.8 pad 1.8)
  other vias: 115.98,93.98
N$339  (via drill 0.8 pad 1.8)
  other vias: 118.52,93.98
N$340  (via drill 0.8 pad 1.8)
  other vias: 118.52,91.44
N$341  (via drill 0.8 pad 1.8)
  other vias: 115.98,91.44
N$342  (via drill 0.8 pad 1.8)
  other vias: 113.44,91.44
N$343  (via drill 0.8 pad 1.8)
  other vias: 110.9,91.44
N$344  (via drill 0.8 pad 1.8)
  other vias: 108.36,91.44
N$345  (via drill 0.8 pad 1.8)
  other vias: 105.82,91.44
N$346  (via drill 0.8 pad 1.8)
  other vias: 103.28,91.44
N$347  (via drill 0.8 pad 1.8)
  other vias: 100.74,91.44
N$348  (via drill 0.8 pad 1.8)
  other vias: 98.2,91.44
N$349  (via drill 0.8 pad 1.8)
  other vias: 98.2,88.9
N$350  (via drill 0.8 pad 1.8)
  other vias: 100.74,88.9
N$351  (via drill 0.8 pad 1.8)
  other vias: 103.28,88.9